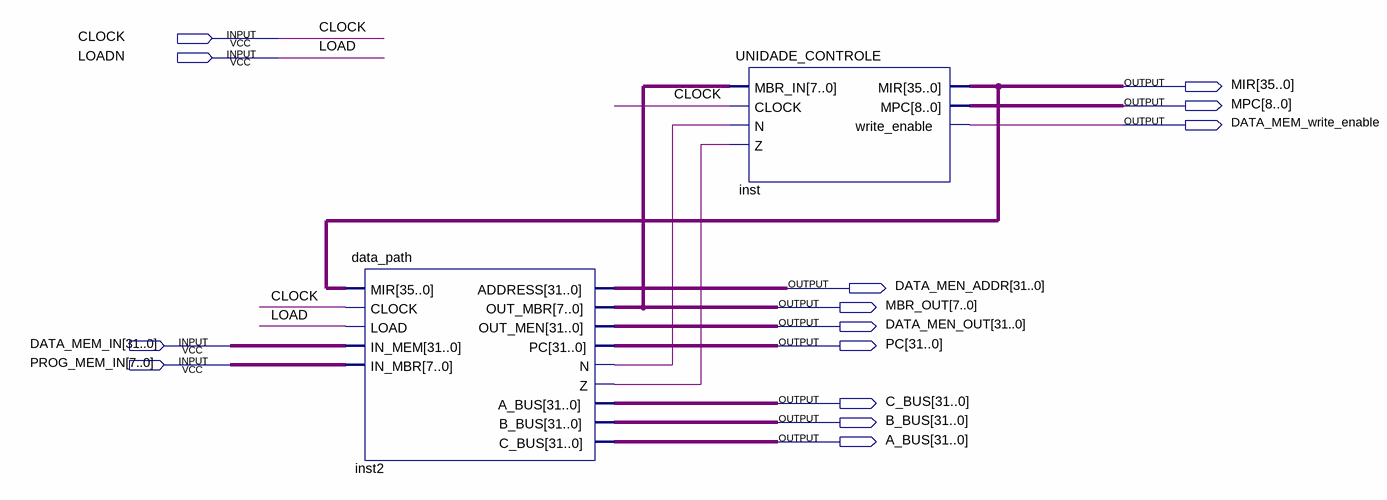
[diagram p0: schematic sheet]
// Quartus schematic ULA.bdf as structural Verilog: 2 symbols, 14 pins
module ULA (
  input  CLOCK,
  input  LOADN,
  input  [31:0] DATA_MEM_IN,
  input  [7:0] PROG_MEM_IN,
  output [35:0] MIR,
  output [8:0] MPC,
  output DATA_MEM_write_enable,
  output [31:0] DATA_MEN_ADDR,
  output [7:0] MBR_OUT,
  output [31:0] DATA_MEN_OUT,
  output [31:0] PC,
  output [31:0] C_BUS,
  output [31:0] B_BUS,
  output [31:0] A_BUS
);

  wire inst2_n, inst2_z;

  data_path inst2 (
    .MIR(MIR), .CLOCK(CLOCK), .LOAD(LOADN), .IN_MEM(DATA_MEM_IN), .IN_MBR(PROG_MEM_IN),
    .ADDRESS(DATA_MEN_ADDR), .OUT_MBR(MBR_OUT), .OUT_MEN(DATA_MEN_OUT), .PC(PC), .N(inst2_n), .Z(inst2_z),
    .A_BUS(C_BUS), .B_BUS(B_BUS), .C_BUS(A_BUS));
  UNIDADE_CONTROLE inst (
    .MBR_IN(MBR_OUT), .CLOCK(CLOCK), .N(inst2_n), .Z(inst2_z), .MIR(MIR), .MPC(MPC),
    .write_enable(DATA_MEM_write_enable));

  // Other names for the same wires on the sheet: LOAD = LOADN
endmodule
